# EAGLE design axe_tomb (EAGLE 9.6.2)
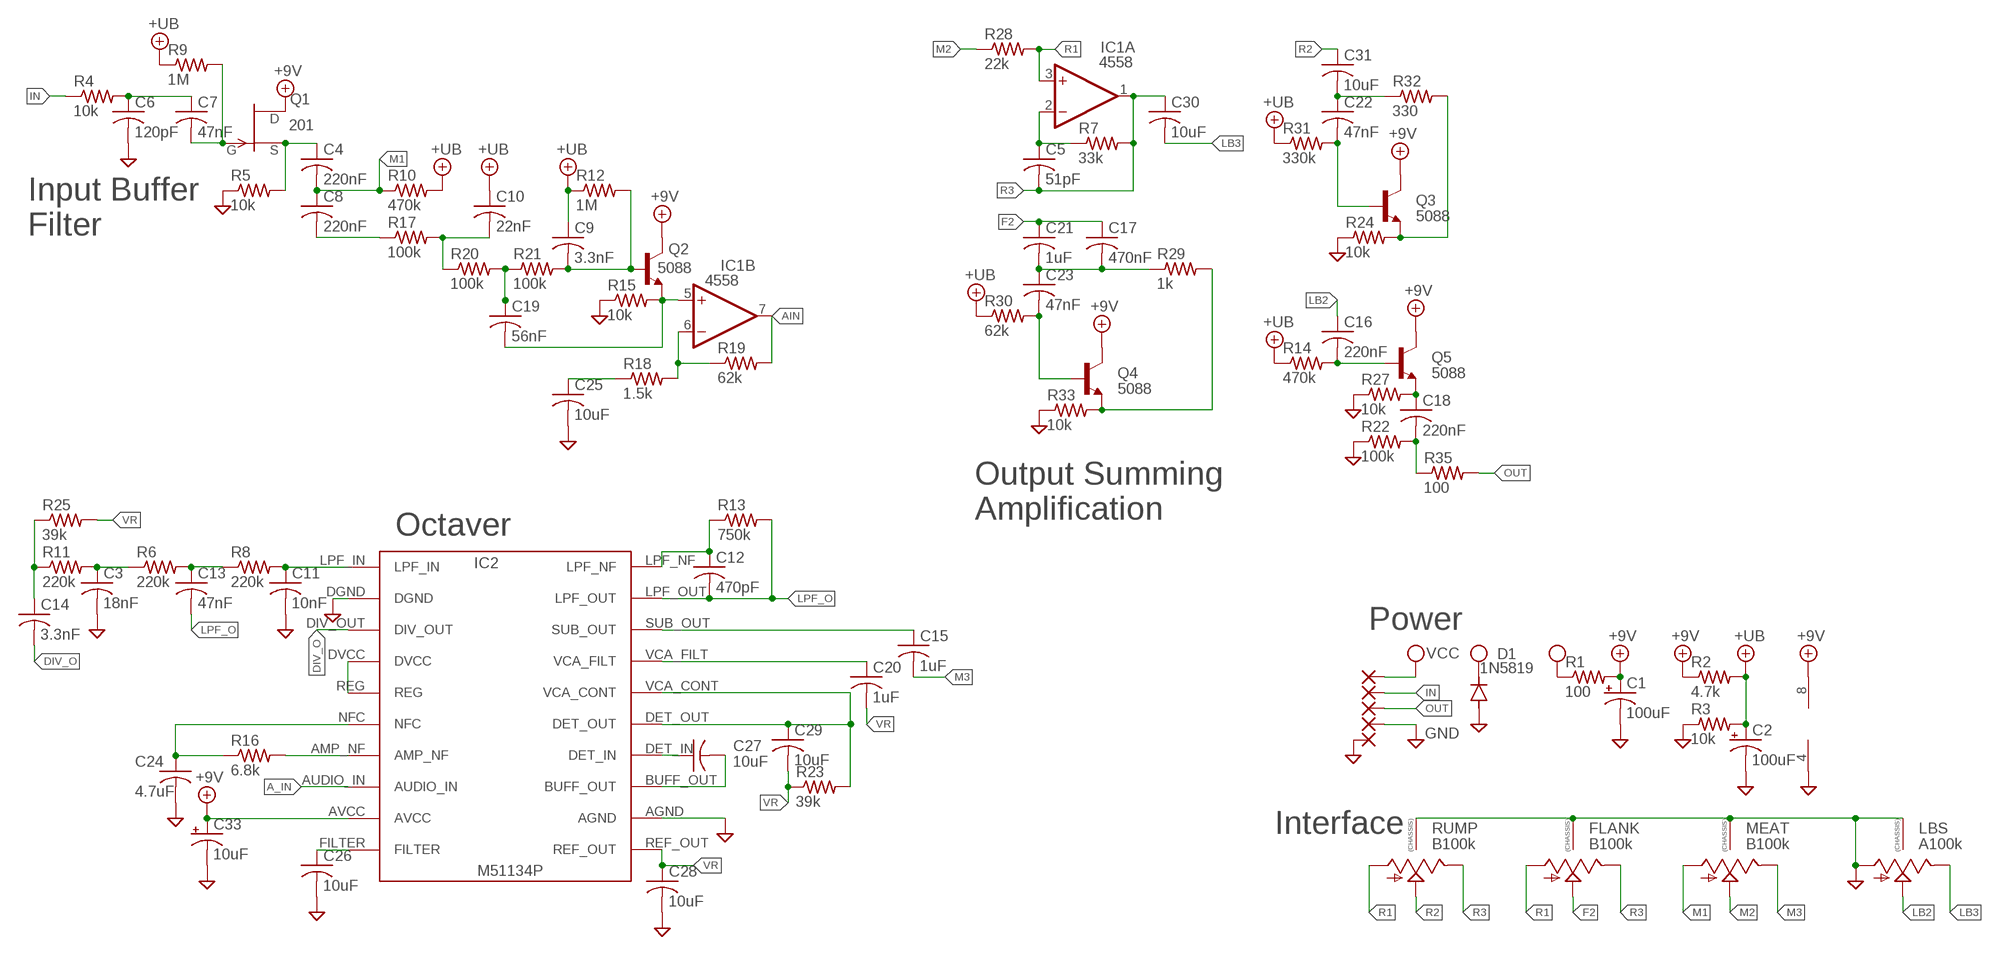
[diagram p0: schematic, sheet 1]

## Parts
C1  100uF  100UF-POLAR-RADIAL-2.5MM-25V-20%  [CPOL-RADIAL-2.5MM-6.5MM]
C2  100uF  100UF-POLAR-RADIAL-2.5MM-25V-20%  [CPOL-RADIAL-2.5MM-6.5MM]
C3  18nF  C-USC0603  [C0603]
C4  220nF  C-USC0603  [C0603]
C5  51pF  C-USC0603  [C0603]
C6  120pF  C-USC0603  [C0603]
C7  47nF  C-USC0603  [C0603]
C8  220nF  C-USC0603  [C0603]
C9  3.3nF  C-USC0603  [C0603]
C10  22nF  C-USC0603  [C0603]
C11  10nF  C-USC0603  [C0603]
C12  470pF  C-USC0603  [C0603]
C13  47nF  C-USC0603  [C0603]
C14  3.3nF  C-USC0603  [C0603]
C15  1uF  C-USC0603  [C0603]
C16  220nF  C-USC0603  [C0603]
C17  470nF  C-USC0603  [C0603]
C18  220nF  C-USC0603  [C0603]
C19  56nF  C-USC0603  [C0603]
C20  1uF  C-USC0603  [C0603]
C21  1uF  C-USC0603  [C0603]
C22  47nF  C-USC0603  [C0603]
C23  47nF  C-USC0603  [C0603]
C24  4.7uF  C-USC1206  [C1206]
C25  10uF  C-USC1206  [C1206]
C26  10uF  C-USC1206  [C1206]
C27  10uF  C-USC1206  [C1206]
C28  10uF  C-USC1206  [C1206]
C29  10uF  C-USC1206  [C1206]
C30  10uF  C-USC1206  [C1206]
C31  10uF  C-USC1206  [C1206]
C33  10uF  C-POL-US_TANTALUM-1206(3216-METRIC)  [CAPMP3216X180N]
D1  1N5819  DIODE-SOD123  [SOD123]
FLANK  B100k  9MM_SNAP-IN_POT_CHASSIS  [9MM_SNAP-IN_POT]
IC1  4558  LM4558D  [SO08]
IC2  M51134P  [M51134P]
LBS  A100k  9MM_SNAP-IN_POT_CHASSIS  [9MM_SNAP-IN_POT]
MEAT  B100k  9MM_SNAP-IN_POT_CHASSIS  [9MM_SNAP-IN_POT]
PAD1  1,6/0,8  [1,6/0,8]
PAD2  1,6/0,8  [1,6/0,8]
PAD3  1,6/0,8  [1,6/0,8]
PAD4  1,6/0,8  [1,6/0,8]
PAD5  1,6/0,8  [1,6/0,8]
Q1  201  SST201  [SOT23]
Q2  5088  TRANSISTOR_NPNMMBT5088  [SOT23]
Q3  5088  TRANSISTOR_NPNMMBT5088  [SOT23]
Q4  5088  TRANSISTOR_NPNMMBT5088  [SOT23]
Q5  5088  TRANSISTOR_NPNMMBT5088  [SOT23]
R1  100  R-US_R0805  [R0805]
R2  4.7k  R-US_R0603  [R0603]
R3  10k  R-US_R0603  [R0603]
R4  10k  R-US_R0603  [R0603]
R5  10k  R-US_R0603  [R0603]
R6  220k  R-US_R0603  [R0603]
R7  33k  R-US_R0603  [R0603]
R8  220k  R-US_R0603  [R0603]
R9  1M  R-US_R0603  [R0603]
R10  470k  R-US_R0603  [R0603]
R11  220k  R-US_R0603  [R0603]
R12  1M  R-US_R0603  [R0603]
R13  750k  R-US_R0603  [R0603]
R14  470k  R-US_R0603  [R0603]
R15  10k  R-US_R0603  [R0603]
R16  6.8k  R-US_R0603  [R0603]
R17  100k  R-US_R0603  [R0603]
R18  1.5k  R-US_R0603  [R0603]
R19  62k  R-US_R0603  [R0603]
R20  100k  R-US_R0603  [R0603]
R21  100k  R-US_R0603  [R0603]
R22  100k  R-US_R0603  [R0603]
R23  39k  R-US_R0603  [R0603]
R24  10k  R-US_R0603  [R0603]
R25  39k  R-US_R0603  [R0603]
R27  10k  R-US_R0603  [R0603]
R28  22k  R-US_R0603  [R0603]
R29  1k  R-US_R0603  [R0603]
R30  62k  R-US_R0603  [R0603]
R31  330k  R-US_R0603  [R0603]
R32  330  R-US_R0603  [R0603]
R33  10k  R-US_R0603  [R0603]
R35  100  R-US_R0603  [R0603]
RUMP  B100k  9MM_SNAP-IN_POT_CHASSIS  [9MM_SNAP-IN_POT]

## Nets
+9V: C1.1(+) C33.1(+) IC1.8(P:V+) IC2.AVCC Q1.1(D) Q2.3(C) Q3.3(C) Q4.3(C) Q5.3(C) R1.2 R2.1
+UB: C2.1(+) C9.1 C10.1 R2.2 R3.2 R9.1 R10.2 R12.1 R14.1 R30.1 R31.1
A_IN: IC2.AUDIO_IN
AIN: IC1.7(B:OUT) R19.2
DIV_O: C14.2 IC2.DIV_OUT
F2: C17.1 C21.1 FLANK.2(S)
GND: C1.2(-) C2.2(-) C3.2 C6.2 C11.2 C24.2 C25.2 C26.2 C28.2 C33.2(-) D1.A FLANK.CHASSIS1 FLANK.CHASSIS2 IC1.4(P:V-) IC2.AGND IC2.DGND LBS.1(A) LBS.CHASSIS1 LBS.CHASSIS2 MEAT.CHASSIS1 MEAT.CHASSIS2 PAD4.1(P) PAD5.1(P) R3.1 R5.1 R15.1 R22.1 R24.1 R27.1 R33.1 RUMP.CHASSIS1 RUMP.CHASSIS2
IN: PAD2.1(P) R4.1
LB2: C16.1 LBS.2(S)
LB3: C30.2 LBS.3(E)
LPF_O: C12.2 C13.2 IC2.LPF_OUT R13.2
M1: C4.2 C8.1 MEAT.1(A) R10.1
M2: MEAT.2(S) R28.1
M3: C15.2 MEAT.3(E)
N$1: C6.1 C7.1 R4.2
N$2: C7.2 Q1.3(G) R9.2
N$3: C4.1 Q1.2(S) R5.2
N$4: C8.2 R17.1
N$5: C10.2 R17.2 R20.1
N$6: C19.1 R20.2 R21.1
N$7: C9.2 Q2.1(B) R12.2 R21.2
N$8: C19.2 IC1.5(B:+IN) Q2.2(E) R15.2
N$9: IC1.6(B:-IN) R18.2 R19.1
N$10: IC2.AMP_NF R16.2
N$11: C25.1 R18.1
N$12: C24.1 IC2.NFC R16.1
N$13: IC2.DVCC IC2.REG
N$14: C27.1 IC2.DET_IN
N$15: C26.1 IC2.FILTER
N$16: C27.2 IC2.BUFF_OUT
N$17: C29.1 IC2.DET_OUT IC2.VCA_CONT R23.2
N$18: C20.1 IC2.VCA_FILT
N$19: C11.1 IC2.LPF_IN R8.2
N$20: C13.1 R6.2 R8.1
N$21: C3.1 R6.1 R11.2
N$22: C14.1 R11.1 R25.1
N$23: C15.1 IC2.SUB_OUT
N$24: C12.1 IC2.LPF_NF R13.1
N$25: C5.1 IC1.2(A:-IN) R7.1
N$26: C22.1 C31.2 R32.1
N$27: C22.2 Q3.1(B) R31.2
N$28: Q3.2(E) R24.2 R32.2
N$29: C17.2 C21.2 C23.1 R29.1
N$30: C23.2 Q4.1(B) R30.2
N$31: Q4.2(E) R29.2 R33.2
N$32: C16.2 Q5.1(B) R14.2
N$33: C18.1 Q5.2(E) R27.2
N$34: C18.2 R22.2 R35.1
OUT: PAD3.1(P) R35.2
R1: FLANK.1(A) IC1.3(A:+IN) R28.2 RUMP.1(A)
R2: C31.1 RUMP.2(S)
R3: C5.2 C30.1 FLANK.3(E) IC1.1(A:OUT) R7.2 RUMP.3(E)
VCC: D1.C PAD1.1(P) R1.1
VR: C20.2 C28.1 C29.2 IC2.REF_OUT R23.1 R25.2

## Notes on the sheet
- Input Buffer
  Filter
- Output Summing
  Amplification
- Octaver
- Power
- Interface

## Library data of the parts
C1 C2 = SparkFun-Capacitors:100UF-POLAR: 100µF polarized capacitors A capacitor is a passive two-terminal electrical component used to store electrical energy temporarily in an electric field.; PROD_ID: CAP-08439
C3-C31 = adafruit:C-US: CAPACITOR, American symbol
C33 = Capacitor:C-POL-US: Capacitor Polarised - ANSI; CATEGORY: Capacitor
D1 = diode:DIODE-: DIODE
FLANK LBS MEAT RUMP = MusicThingModular:9MM_SNAP-IN_POT_CHASSIS: 9mm vertical snap-in pot, Alpha / Panasonic style, with a connection to the metal chassis for grounding
IC1 = linear:*4558: OP AMP
IC2 = MITSUBISHI_M51134P:M51134P
PAD1-PAD5 = wirepad:1,6/0,8: THROUGH-HOLE PAD
Q1 = transistor-fet:?20*: TEMIC / Siliconix N-Channel JFET Source: JFET-J201_Siliconix_data.pdf
Q2-Q5 = SparkFun-DiscreteSemi:TRANSISTOR_NPN: Generic NPN BJT MMBT2222A - TRANS-08049 (SOT-23, 1A 40V) MPSA42 - TRANS-09116 (SOT-23, 500mA 300V) MMBT5088LT1G - TRANS-11160 (SOT-23, 50 mA 30V) BC547 - COM-08928 <http://www.sparkfun.com/products/8928> (TO-92 45V 100mA) (1.Collector 2.Base 3.Emitter) 2N3904 - COM-00521 <http://www.sparkfun.com/products/521> (TO-92 40V 200mA) (1.Emitter 2.Base 3.Collector) P2N2222A - COM-12852 <http://www.sparkfun.com/products/12852> (TO-92 40V 600mA) (1.Collector 2.Base 3.Emitter); PROD_ID: TRANS-11160; VALUE: MMBT5088
R1-R25 R27-R33 R35 = adafruit:R-US_: RESISTOR, American symbol

## Board
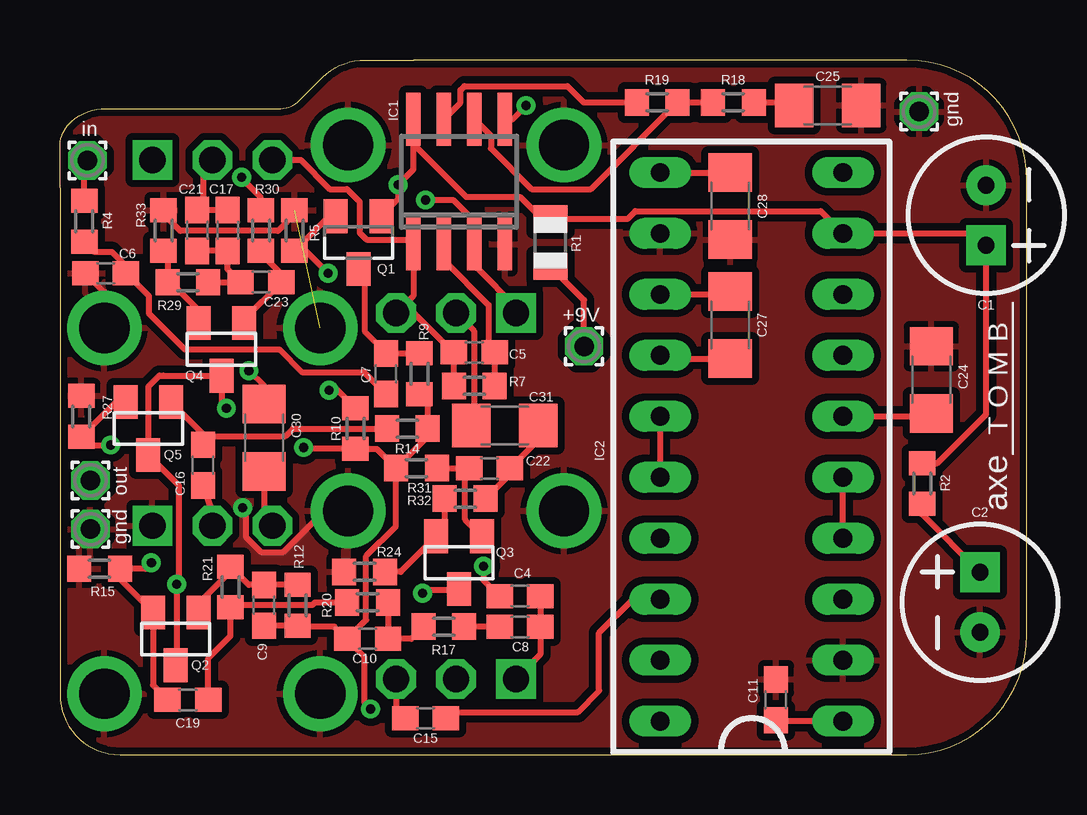
[diagram p1: board, top side]
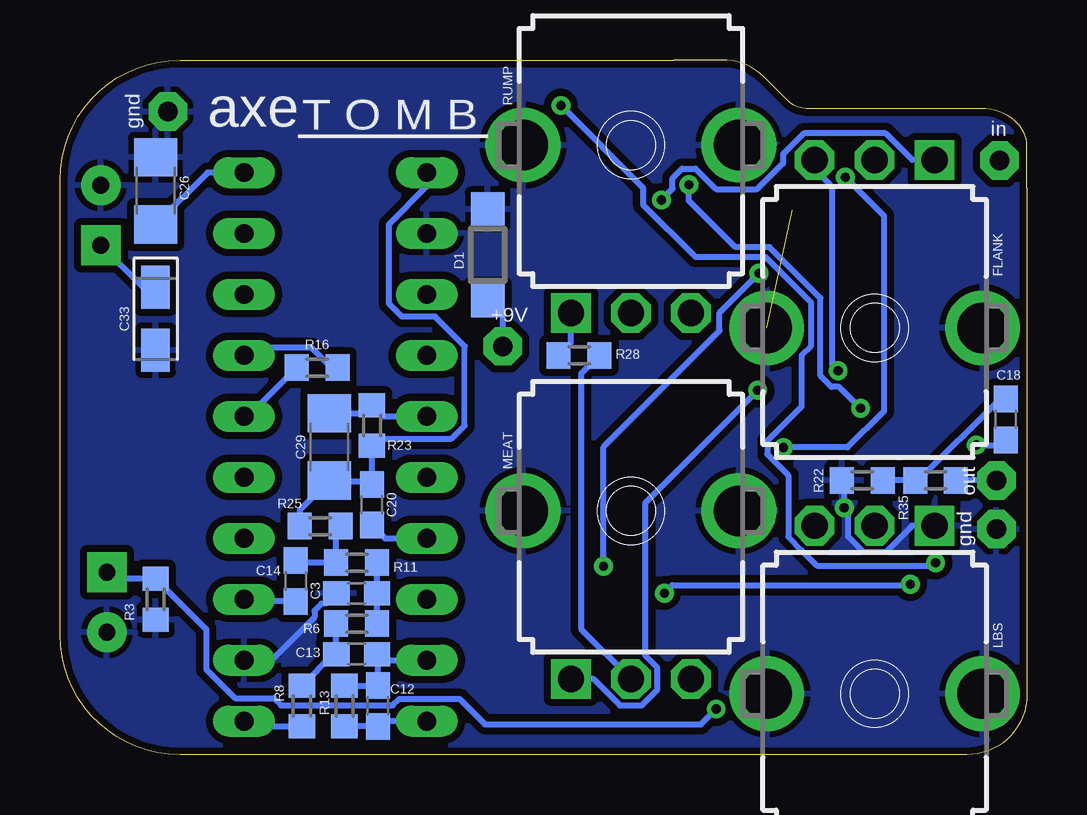
[diagram p2: board, bottom side, seen from below]

Size 40.31 x 28.95 mm. Coordinates in mm from the lower left corner, seen from the top.
Outline: 0,23.62 0,2.5 arc90 2.5,0 35.31,0 arc90 40.31,5 40.31,23.95 arc90 35.31,28.95 14.73,28.95 12.72,28.95 arc45 10.95,28.22 9.91,27.18 arc-45 8.99,26.92 1.91,26.92 arc45 0.35,26.26 0.38,26.29 arc45 0,25.3 0,23.62
Copper layers (1*16): Top 0.035mm / dielectric 1.5mm / Bottom 0.035mm
Design rules "default *": minimum track width 6mil, minimum drill 0.35mm, track to track 6mil, track to pad 6mil, pad to pad 6mil, via to via 6mil, smd to smd 6mil, copper to edge 10mil, drill to drill 6mil, minimum pad ring 10mil, minimum via ring 8mil, stop-mask expansion 4mil, vias tented up to drill 0mil, thermal gap 10mil

### Footprints (pad centres in the part's own frame; a part is rotated, then mirrored left to right if it is on the bottom)
CPOL-RADIAL-2.5MM-6.5MM = drill 0.7 pad 1.651 square: 1 1.25,0 | drill 0.7 pad 1.651: 2 -1.25,0
C0603 = smd 1.1 x 1: 1 -0.85,0; 2 0.85,0
C1206 = smd 1.6 x 1.8: 1 -1.4,0; 2 1.4,0
CAPMP3216X180N = smd 1.796 x 1.189: 1 -1.31,0; 2 1.31,0
SOD123 = smd 1.4 x 1.4: A 1.9,0; C -1.9,0
9MM_SNAP-IN_POT = drill 1.1 square: 1 -2.5,-7 | drill 1.1 octagon: 2 0,-7; 3 2.5,-7 | drill 2.1 pad 2.794: CHASSIS1 -4.5,0; CHASSIS2 4.5,0
SO08 = smd 0.6 x 2.2: 1 -1.905,-2.6; 2 -0.635,-2.6; 3 0.635,-2.6; 4 1.905,-2.6; 5 1.905,2.6; 6 0.635,2.6; 7 -0.635,2.6; 8 -1.905,2.6
M51134P = drill 0.787 long: AGND 3.81,-10.16; AMP_NF -3.81,-5.08; AUDIO_IN -3.81,-7.62; AVCC -3.81,-10.16; BUFF_OUT 3.81,-7.62; DET_IN 3.81,-5.08; DET_OUT 3.81,-2.54; DGND -3.81,7.62; DIV_OUT -3.81,5.08; DVCC -3.81,2.54; FILTER -3.81,-12.7; LPF_IN -3.81,10.16; LPF_NF 3.81,10.16; LPF_OUT 3.81,7.62; NFC -3.81,-2.54; REF_OUT 3.81,-12.7; REG -3.81,0; SUB_OUT 3.81,5.08; VCA_CONT 3.81,0; VCA_FILT 3.81,2.54
1,6/0,8 = drill 0.813 pad 1.6 octagon: 1 0,0
SOT23 = smd 1 x 1.4: 1 -0.95,-1.1; 2 0.95,-1.1; 3 0,1.1
R0805 = smd 1.1 x 1.4: 1 -1,0; 2 1,0
R0603 = smd 1 x 1.1: 1 -0.85,0; 2 0.85,0

### Placement (x,y rotation side)
C1  38.61,22.48 270 top
C2  38.35,6.35 90 top
C3  27.94,6.73 180 bottom
C4  19.18,6.6 0 top
C5  17.27,16.76 180 top
C6  1.91,20.07 180 top
C7  13.59,15.88 90 top
C8  19.18,5.33 180 top
C9  8.51,6.22 90 top
C10  12.83,4.83 0 top
C11  29.84,2.29 90 top
C12  27.05,2.03 90 bottom
C13  27.94,4.19 0 bottom
C14  30.48,7.24 270 bottom
C15  15.24,1.52 180 top
C16  5.97,12.06 90 top
C17  6.99,21.84 270 top
C18  0.89,13.97 90 bottom
C19  5.33,2.29 180 top
C20  27.3,10.41 90 bottom
C21  5.71,21.84 270 top
C22  17.91,11.94 180 top
C23  8.38,19.68 0 top
C24  36.32,15.62 90 top
C25  32,27.05 0 top
C26  36.32,23.5 90 bottom
C27  27.94,17.91 90 top
C28  27.94,22.86 270 top
C29  29.08,12.83 270 bottom
C30  8.51,13.21 270 top
C31  18.54,13.72 0 top
C33  36.32,18.16 270 bottom
D1  22.48,20.83 90 bottom
FLANK  6.35,17.78 180 bottom
IC1  16.64,23.88 0 top
IC2  28.83,11.56 180 top
LBS  6.35,2.54 180 bottom
MEAT  16.51,10.16 0 bottom
PAD1  21.84,17.02 0 top
PAD2  1.14,24.77 0 top
PAD3  1.27,11.43 0 top
PAD4  35.81,26.8 0 top
PAD5  1.27,9.4 0 top
Q1  12.45,21.34 180 top
Q2  4.83,4.83 180 top
Q3  16.64,8 180 top
Q4  6.73,16.89 180 top
Q5  3.68,13.59 180 top
R1  20.45,21.34 90 top
R2  35.94,11.3 270 top
R3  36.32,6.48 90 bottom
R4  1.02,22.23 270 top
R5  9.78,21.84 270 top
R6  27.94,5.46 180 bottom
R7  17.27,15.37 180 top
R8  30.23,2.03 270 bottom
R9  14.99,15.88 90 top
R10  12.32,13.59 270 top
R11  27.94,8 0 bottom
R12  9.91,6.22 90 top
R13  28.45,2.03 90 bottom
R14  14.48,13.59 180 top
R15  1.65,7.75 0 top
R16  29.59,16.13 0 bottom
R17  16,5.33 180 top
R18  28.07,27.18 180 top
R19  24.89,27.18 180 top
R20  12.83,6.35 180 top
R21  7.11,6.99 90 top
R22  6.86,11.43 0 bottom
R23  27.3,13.72 90 bottom
R24  12.7,7.62 0 top
R25  29.46,9.53 180 bottom
R27  0.89,14.1 270 top
R28  18.67,16.64 180 bottom
R29  5.33,19.68 180 top
R30  8.38,21.84 270 top
R31  14.86,11.94 0 top
R32  16.89,10.67 180 top
R33  4.32,21.84 270 top
R35  3.81,11.43 0 bottom
RUMP  16.51,25.4 0 bottom

### Tracks (layer width: path | path; a pad name or v marks a point on that pad's centre or on a via)
+9V  (via drill 0.38)
  Top 0.254: Q2.3 4.74,3.64 4.74,4.02 4.87,4.15 v4.87,7.11 4.95,7.19 4.95,11.22 Q5.3 3.68,15.33 4.14,15.79 4.31,15.79 4.32,15.79 Q4.3 6.73,14.63 v6.93,14.43 | IC1.8 14.73,25.44 | 14.73,25.44 16.93,23.24 19.18,23.24 19.94,22.48 19.94,22.1 20.21,22.1 R1.2 23.68,22.34 23.99,22.64 31.71,22.64 IC2.AVCC 38.12,21.72 C1.1 38.61,14.19 36.58,12.15 R2.1 | Q3.3 16.59,6.86 15.24,6.86 v15.11,6.73 | Q1.1 14.1,23.14 v14.1,23.75 14.73,24.38 14.73,25.44
  Bottom 0.254: C33.1 36.85,19.47 C1.1 | v15.11,6.73 14.78,7.06 4.91,7.06 v4.87,7.11 | v6.93,14.43 7.84,15.33 8.15,15.33 8.61,15.78 8.61,19.02 10.73,21.14 12.15,21.14 14.1,23.09 v14.1,23.75
+UB  (via drill 0.38)
  Top 0.254: 11.94,4.83 C10.1 12.77,5.62 12.77,8.29 14.01,9.52 R31.1 | C9.1 R12.1 9.95,5.33 11.43,5.33 11.94,4.83 | R31.1 15.33,13.26 R14.1 15.33,14.68 R9.1 | C2.1 35.94,10.01 R2.2 | R31.1 13.21,12.74 R10.2 10.21,12.74 v10.15,12.8 | v7.57,24.06 7.57,24.02 8.38,23.2 R30.1 | v12.95,1.91 12.69,2.17 12.69,4.08 11.94,4.83
  Bottom 0.254: C2.1 38.08,7.33 R3.2 34.21,5.22 34.21,3.55 33.02,2.36 31.4,2.36 31.1,2.05 26.43,2.05 26.16,2.32 23.65,2.32 22.59,1.27 13.59,1.27 v12.95,1.91 | v7.57,24.06 5.96,22.46 5.96,14.32 7.48,12.8 v10.15,12.8
AIN
  Top 0.254: IC1.7 16.69,27.17 16.69,27.69 16.86,27.86 21.15,27.86 21.83,27.18 R19.2
DIV_O
  Bottom 0.254: C14.2 32.55,6.39 IC2.DIV_OUT
F2
  Top 0.254: C17.1 C21.1 5.97,22.95 5.97,24.4 FLANK.2
GND  (via drill 0.38)  (1 unrouted)
  Top 0.254: C6.2 1.85,19.27 FLANK.CHASSIS1 | R5.1 9.46,22.38 9.46,22.2 9.08,21.82 5.01,21.82 4.32,22.52 R33.1 | v7.62,10.29 7.75,10.16 7.75,9.08 8.39,8.44 9.31,8.44 11.03,10.16 MEAT.CHASSIS2
  Bottom 0.254: C3.2 29.23,6.29 29.41,6.29 29.7,6 29.7,5.72 31.49,3.94 IC2.DGND | LBS.1 4.79,9.54 5.89,8.44 6.81,8.44 7.45,9.08 7.45,10.12 v7.62,10.29 7.62,11.34 R22.1
  pour Top (isolate 0.305): -1.27,-1.27 43.18,-1.27 43.18,30.48 -1.27,30.48
  pour Bottom (isolate 0.305): -1.27,-1.27 43.18,-1.27 43.18,30.48 -1.27,30.48
IN
  Top 0.254: R4.1 1.02,24.64 PAD2.1
LB2
  Top 0.254: C16.1 6.35,10.07 LBS.2
LB3
  Top 0.254: LBS.3 8.51,9.88 C30.2
LPF_O
  Bottom 0.254: R13.2 C12.2 27.05,4.15 C13.2 26.84,3.94 IC2.LPF_OUT
M1  (via drill 0.38)
  Top 0.254: C4.2 C8.1 20.03,4.18 MEAT.1 | R10.1 11.58,15.18 v11.22,15.18
  Bottom 0.254: 15.91,10.49 v11.22,15.18 | MEAT.1 18.07,3.16 16.97,2.06 16.05,2.06 15.41,2.7 15.41,3.62 15.91,4.12 15.91,10.49 | 15.91,10.49
M2
  Bottom 0.254: R28.1 18.58,15.88 18.58,5.23 MEAT.2
M3
  Top 0.254: MEAT.3 14.01,1.9 C15.2
N$1
  Top 0.254: R4.2 1.44,20.95 2.16,20.95 2.75,20.36 C6.1 3.71,19.12 3.71,18.38 5.2,16.89 9.15,16.89 10.09,15.94 12.67,15.94 C7.1
N$2
  Top 0.254: Q1.3 12.7,19.98 12.7,17.65 13.59,16.76 C7.2 R9.2
N$3  (via drill 0.38)
  Top 0.254: Q1.2 11.22,22.44 R5.2 10.25,20.99 v11.18,20.07 | v17.65,7.86 17.65,7.28 C4.1
  Bottom 0.254: v17.65,7.86 17.65,12.83 12.81,17.67 12.81,18.41 11.18,20.05 v11.18,20.07
N$4
  Top 0.254: C8.2 R17.1
N$5
  Top 0.254: R20.1 C10.2 14.64,4.83 R17.2
N$6
  Top 0.254: C19.1 6.18,4.03 7.11,4.95 R21.1 7.22,6.24 10.52,6.24 10.63,6.35 R20.2
N$7
  Top 0.254: R12.2 C9.2 7.87,7.07 R21.2 7.11,7.64 5.78,6.31 Q2.1
N$8  (via drill 0.38)
  Top 0.254: C19.2 3.88,2.89 Q2.2 2.5,7.3 R15.2 3.56,7.75 v3.81,8 | IC1.5 18.86,26.48 v19.43,27.05
  Bottom 0.254: v19.43,27.05 16,23.62 16,22.92 13.82,20.74 10.9,20.74 9.01,18.86 9.01,17.02 9.4,16.63 9.4,14.51 10.82,13.08 10.82,12.52 9.95,11.65 9.95,9.08 9.4,8.53 9.4,8.51 8.76,7.87 3.94,7.87 v3.81,8
N$9
  Top 0.254: IC1.6 17.96,25.79 17.96,25.26 19.66,23.56 22.13,23.56 R19.1 R18.2
N$10
  Bottom 0.254: R16.2 29,16.13 29.82,16.96 31.94,16.96 32,17.02 32.26,17.02 IC2.AMP_NF
N$11
  Top 0.254: R18.1 30.48,27.18 C25.1
N$12
  Top 0.254: IC2.NFC 36.2,14.1 C24.1
  Bottom 0.254: R16.1 32.47,14.1 IC2.NFC
N$13
  Top 0.254: IC2.DVCC IC2.REG
N$14
  Top 0.254: IC2.DET_IN 25.15,16.51 C27.1
N$15
  Bottom 0.254: IC2.FILTER 34.16,24.26 C26.1
N$16
  Top 0.254: IC2.BUFF_OUT 27.81,19.18 C27.2
N$17
  Top 0.254: IC2.DET_OUT IC2.VCA_CONT
  Bottom 0.254: C29.1 27.64,14.23 R23.2 26.84,14.1 IC2.DET_OUT
N$18
  Bottom 0.254: C20.1 26.76,9.02 IC2.VCA_FILT
N$19
  Top 0.254: IC2.LPF_IN 29.88,1.4 C11.1
  Bottom 0.254: IC2.LPF_IN 32.42,1.18 R8.2
N$20
  Bottom 0.254: R6.2 C13.1 28.92,4.19 R8.1
N$21
  Bottom 0.254: R6.1 C3.1 R11.2
N$22
  Bottom 0.254: R25.1 28.79,9.35 R11.1 30.39,8 C14.1
N$23
  Top 0.254: C15.1 16.34,1.78 21.59,1.78 22.48,2.67 22.48,5.08 23.88,6.48 IC2.SUB_OUT
N$24
  Bottom 0.254: IC2.LPF_NF 26.84,1.4 C12.1 R13.1
N$25
  Top 0.254: IC1.2 16,20.6 17.87,18.73 17.87,17.02 C5.1 R7.1
N$26
  Top 0.254: R32.1 18.76,11.68 C22.1 19.94,13.12 C31.2
N$27
  Top 0.254: R31.2 16.89,11.94 | 16.89,11.94 C22.2 | Q3.1 16.89,9.8 16.89,11.94
N$28
  Top 0.254: R32.2 16.04,9.46 Q3.2 14.21,7.62 R24.2
N$29
  Top 0.254: R29.1 C23.1 6.99,20.23 C17.2 C21.2
N$30
  Top 0.254: Q4.1 7.68,18.13 C23.2 9.23,20.02 8.38,20.87 R30.2
N$31
  Top 0.254: R33.2 4.48,20.83 R29.2 4.61,19.68 5.78,18.52 Q4.2
N$32
  Top 0.254: R14.2 9.71,13.59 9.4,13.28 6.33,13.28 C16.2 5.97,13.35 Q5.1
N$33  (via drill 0.38)
  Top 0.254: Q5.2 2.33,14.69 R27.2 1.23,12.9 v2.11,12.9
  Bottom 0.254: v2.11,12.9 1.11,12.9 C18.1
N$34
  Bottom 0.254: R22.2 R35.1 4.53,11.43 1.14,14.82 C18.2
OUT
  Bottom 0.254: PAD3.1 R35.2
R1  (via drill 0.38)
  Top 0.254: RUMP.1 19.01,18.65 17.4,20.27 17.4,21.15 IC1.3 17.27,22.23 16.38,23.11 v15.24,23.11
  Bottom 0.254: R28.2 19.01,17.15 RUMP.1 | FLANK.1 4.79,24.78 5.89,25.88 9.31,25.88 10.17,25.02 10.17,24.64 11.25,23.56 12.96,23.56 13.82,24.42 14.38,24.42 14.77,24.03 14.77,23.58 v15.24,23.11
R2
  Top 0.254: RUMP.2 17.25,17.66 17.25,13.82 C31.1
R3  (via drill 0.38)
  Top 0.254: R7.2 C5.2 16.39,16.76 14.76,18.4 RUMP.3 14.73,19.12 IC1.1 14.55,21.46 12.78,21.46 12.49,21.75 12.49,23.04 11.96,23.56 11.25,23.56 10.03,24.78 FLANK.3 | v7.87,16 8.51,15.37 C30.1
  Bottom 0.254: FLANK.3 8.85,24.4 8.24,23.79 8.24,23.78 8.13,23.67 8.13,16.26 v7.87,16
VCC
  Top 0.254: PAD1.1 21.84,18.94 R1.1
  Bottom 0.254: PAD1.1 21.84,18.29 D1.C
VR
  Top 0.254: IC2.REF_OUT C28.1
  Bottom 0.254: C29.2 29.14,11.37 | 29.14,11.37 30.31,10.2 R25.2 | 29.14,11.37 27.41,11.37 C20.2 R23.1 27,13.17 23.99,13.17 23.44,13.71 23.44,17.02 24.67,18.25 26.05,18.25 26.59,18.79 26.59,22.1 25.02,23.68 IC2.REF_OUT

### Text on the board
tPlace: in | gnd | +9V | T O M B | out | axe________ | gnd
bPlace: gnd | in | T O M B | axe______ | +9V | out | gnd